# EAGLE design OperantFEDv3 (EAGLE 7.7.0)
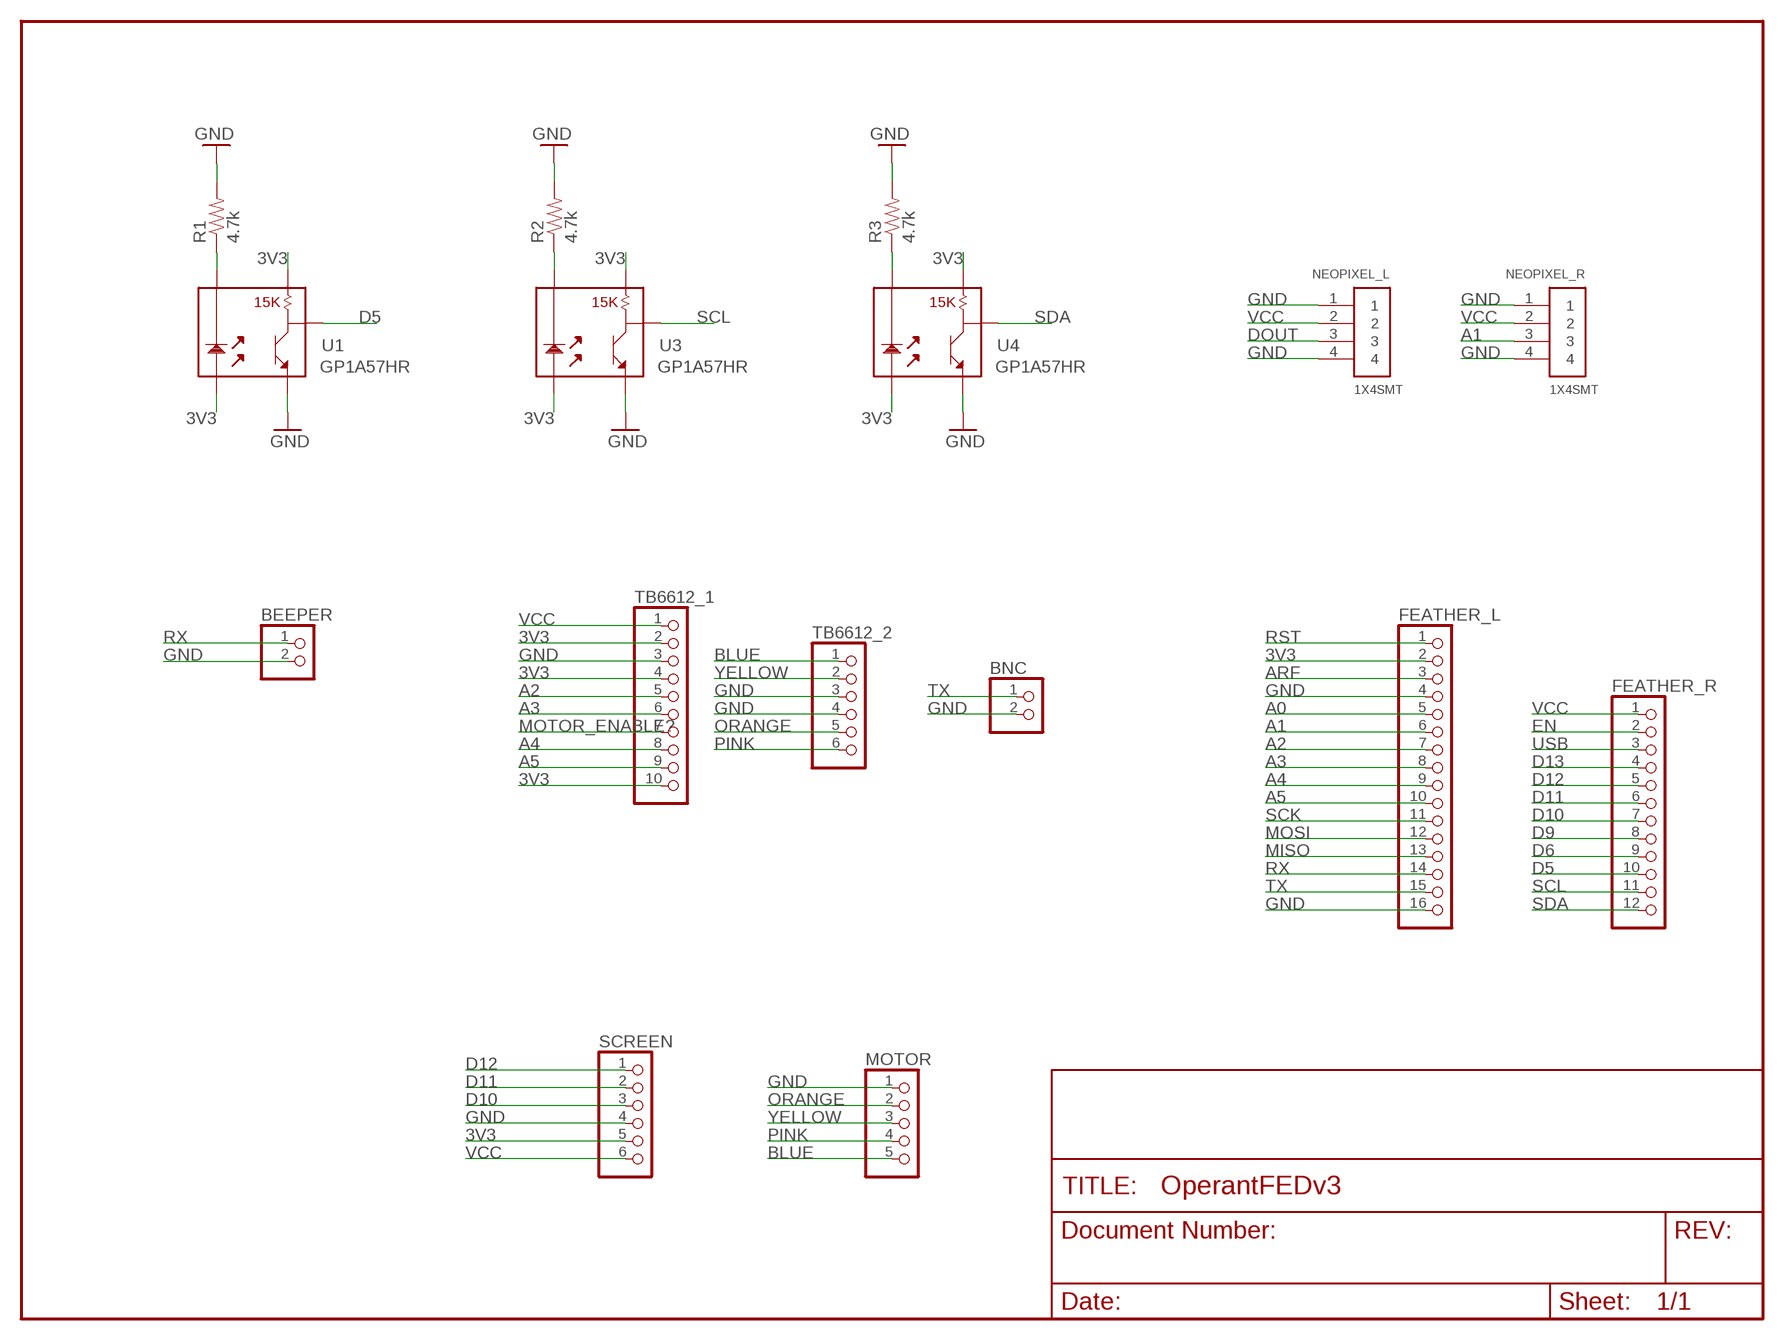
[diagram p0: schematic, sheet 1]

## Parts
BEEPER  PINHD-1X2  [1X02]
BNC  PINHD-1X2  [1X02]
FEATHER_L  PINHD-1X16  [1X16]
FEATHER_R  PINHD-1X12  [1X12]
MOTOR  PINHD-1X5  [1X05]
NEOPIXEL_L  1X4SMT  [1X4-SMT]
NEOPIXEL_R  1X4SMT  [1X4-SMT]
R1  4.7k  RESISTORPTH1  [AXIAL-0.3]
R2  4.7k  RESISTORPTH1  [AXIAL-0.3]
R3  4.7k  RESISTORPTH1  [AXIAL-0.3]
SCREEN  PINHD-1X6  [1X06]
TB6612_1  PINHD-1X10  [1X10]
TB6612_2  PINHD-1X6  [1X06]
U1  GP1A57HR  [GP1A57HR]
U3  GP1A57HR  [GP1A57HR]
U4  GP1A57HR  [GP1A57HR]

## Nets
3V3: FEATHER_L.2 SCREEN.5 TB6612_1.2 TB6612_1.4 TB6612_1.10 U1.1 U1.3 U3.1 U3.3 U4.1 U4.3
A0: FEATHER_L.5
A1: FEATHER_L.6 NEOPIXEL_R.3
A2: FEATHER_L.7 TB6612_1.5
A3: FEATHER_L.8 TB6612_1.6
A4: FEATHER_L.9 TB6612_1.8
A5: FEATHER_L.10 TB6612_1.9
ARF: FEATHER_L.3
BLUE: MOTOR.5 TB6612_2.1
D5: FEATHER_R.10 U1.4
D6: FEATHER_R.9
D9: FEATHER_R.8
D10: FEATHER_R.7 SCREEN.3
D11: FEATHER_R.6 SCREEN.2
D12: FEATHER_R.5 SCREEN.1
D13: FEATHER_R.4
DOUT: NEOPIXEL_L.3
EN: FEATHER_R.2
GND: BEEPER.2 BNC.2 FEATHER_L.4 FEATHER_L.16 MOTOR.1 NEOPIXEL_L.1 NEOPIXEL_L.4 NEOPIXEL_R.1 NEOPIXEL_R.4 R1.P$2 R2.P$2 R3.P$2 SCREEN.4 TB6612_1.3 TB6612_2.3 TB6612_2.4 U1.5 U3.5 U4.5
MISO: FEATHER_L.13
MOSI: FEATHER_L.12
MOTOR_ENABLE?: TB6612_1.7
N$1: R2.P$1 U3.2
N$2: R1.P$1 U1.2
N$3: R3.P$1 U4.2
ORANGE: MOTOR.2 TB6612_2.5
PINK: MOTOR.4 TB6612_2.6
RST: FEATHER_L.1
RX: BEEPER.1 FEATHER_L.14
SCK: FEATHER_L.11
SCL: FEATHER_R.11 U3.4
SDA: FEATHER_R.12 U4.4
TX: BNC.1 FEATHER_L.15
USB: FEATHER_R.3
VCC: FEATHER_R.1 NEOPIXEL_L.2 NEOPIXEL_R.2 SCREEN.6 TB6612_1.1
YELLOW: MOTOR.3 TB6612_2.2

## Library data of the parts
BEEPER BNC = pinhead:PINHD-1X2: PIN HEADER
FEATHER_L = pinhead:PINHD-1X16: PIN HEADER
FEATHER_R = pinhead:PINHD-1X12: PIN HEADER
MOTOR = pinhead:PINHD-1X5: PIN HEADER
NEOPIXEL_L NEOPIXEL_R = adafruit:1X4: 4-pin connector
R1-R3 = SparkFun:RESISTOR: Resistor Basic schematic elements and footprints for 0603, 1206, and PTH 1/10th watt (small) resistors.
SCREEN TB6612_2 = pinhead:PINHD-1X6: PIN HEADER
TB6612_1 = pinhead:PINHD-1X10: PIN HEADER
U1 U3 U4 = SparkFun:GP1A57HR

## Board
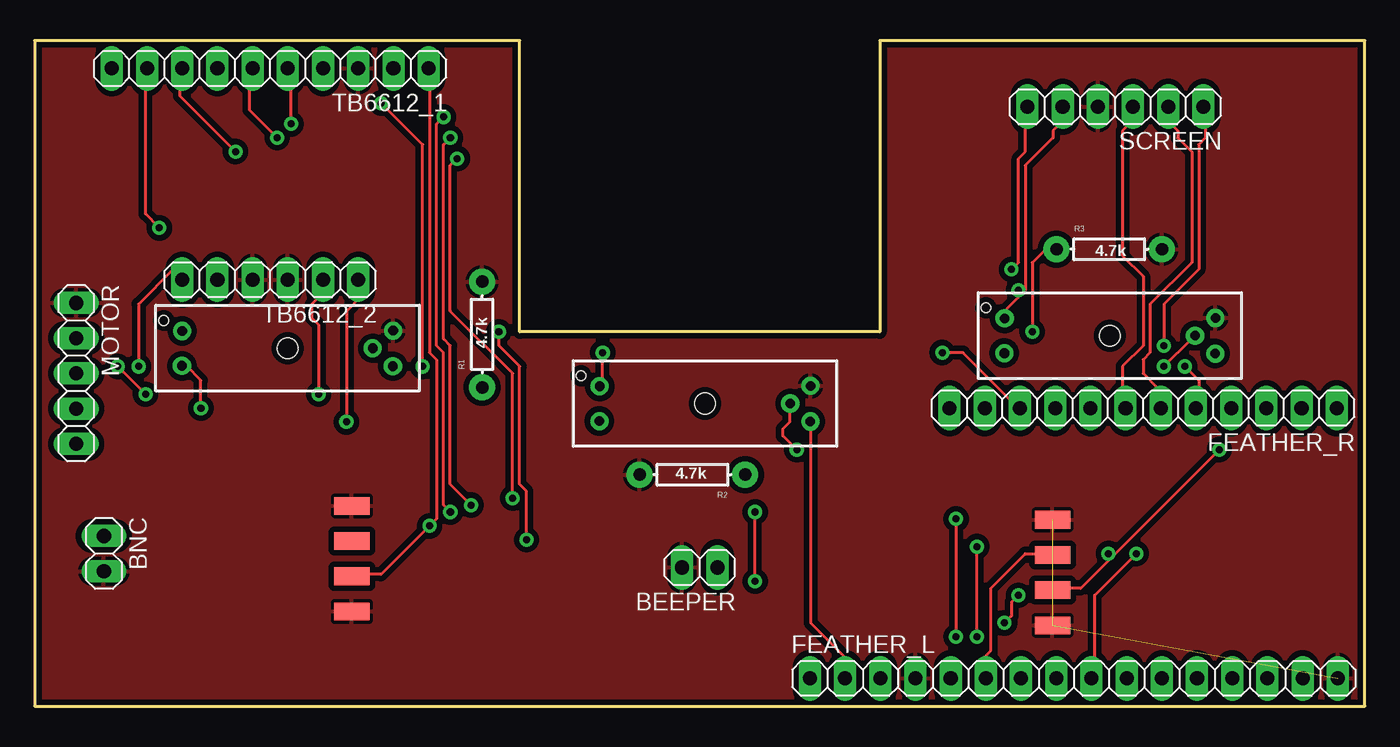
[diagram p1: board, top side]
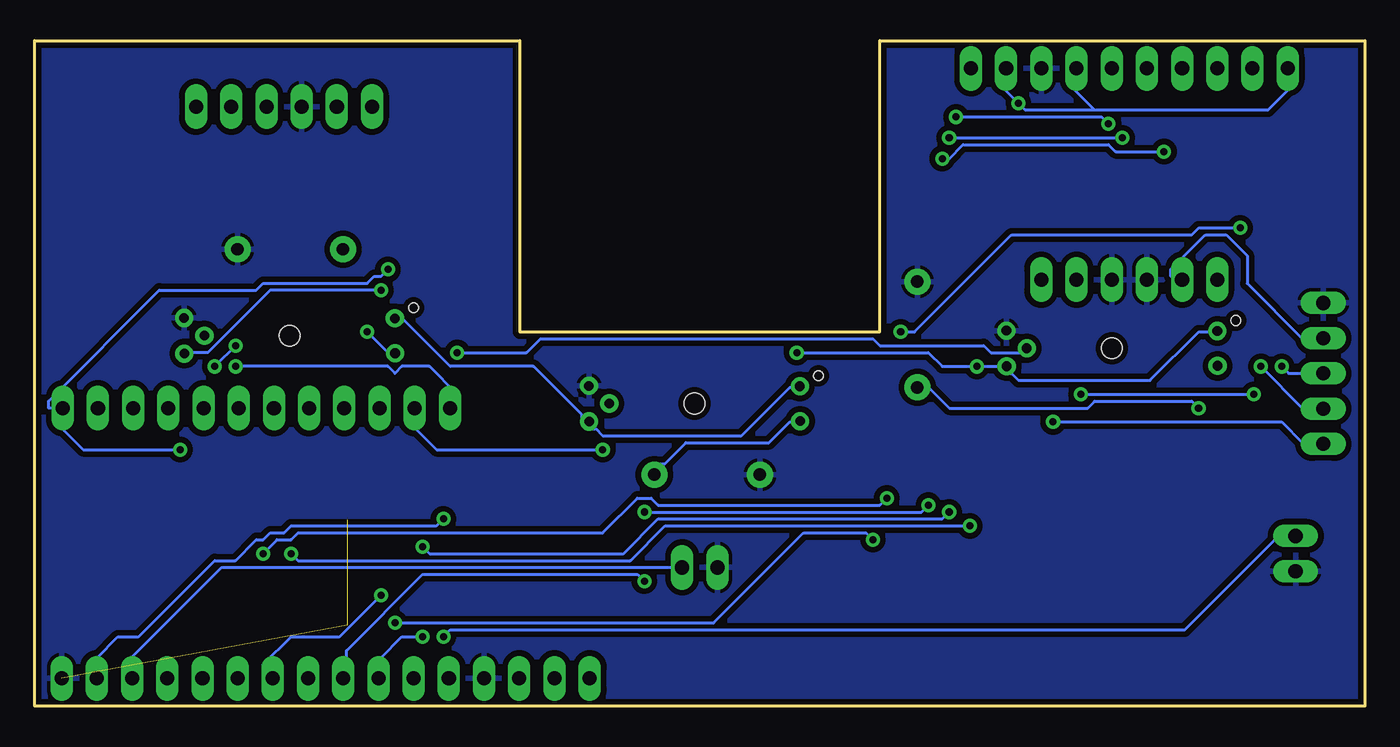
[diagram p2: board, bottom side, seen from below]

Size 96 x 48 mm. Coordinates in mm from the lower left corner, seen from the top.
Outline: 0,0 96,0 96,48 61,48 61,27 35,27 35,48 0,48 0,0
Copper layers (1*16): Top 0.0356mm / dielectric 1.5011mm / Bottom 0.0356mm
Design rules "default": minimum track width 8mil, minimum drill 20mil, track to track 8mil, track to pad 8mil, pad to pad 8mil, via to via 8mil, smd to smd 8mil, copper to edge 10mil, drill to drill 8mil, minimum pad ring 12mil, minimum via ring 10mil, stop-mask expansion 4mil, vias tented up to drill 20mil, thermal gap 10mil

### Footprints (pad centres in the part's own frame; a part is rotated, then mirrored left to right if it is on the bottom)
1X02 = drill 1.016 long: 1 -1.27,0; 2 1.27,0
1X16 = drill 1.016 long: 1 -19.05,0; 2 -16.51,0; 3 -13.97,0; 4 -11.43,0; 5 -8.89,0; 6 -6.35,0; 7 -3.81,0; 8 -1.27,0; 9 1.27,0; 10 3.81,0; 11 6.35,0; 12 8.89,0; 13 11.43,0; 14 13.97,0; 15 16.51,0; 16 19.05,0
1X12 = drill 1.016 long: 1 -13.97,0; 2 -11.43,0; 3 -8.89,0; 4 -6.35,0; 5 -3.81,0; 6 -1.27,0; 7 1.27,0; 8 3.81,0; 9 6.35,0; 10 8.89,0; 11 11.43,0; 12 13.97,0
1X05 = drill 1.016 long: 1 -5.08,0; 2 -2.54,0; 3 0,0; 4 2.54,0; 5 5.08,0
1X4-SMT = smd 1.27 x 2.54: 1 -3.81,0; 2 -1.27,0; 3 1.27,0; 4 3.81,0
AXIAL-0.3 = drill 0.9 pad 1.88: P$1 -3.81,0; P$2 3.81,0
1X06 = drill 1.016 long: 1 -6.35,0; 2 -3.81,0; 3 -1.27,0; 4 1.27,0; 5 3.81,0; 6 6.35,0
1X10 = drill 1.016 long: 1 -11.43,0; 2 -8.89,0; 3 -6.35,0; 4 -3.81,0; 5 -1.27,0; 6 1.27,0; 7 3.81,0; 8 6.35,0; 9 8.89,0; 10 11.43,0
GP1A57HR = drill 0.7: 1 -7.6,1.24; 2 -7.62,-1.27; 3 7.6,-1.3; 4 6.15,0; 5 7.62,1.27 | hole 1.5: 0,0 | hole 0.7: -8.95,2

### Placement (x,y rotation side)
BEEPER  48,10 180 top
BNC  5,11 270 top
FEATHER_L  75,2 0 top
FEATHER_R  80,21.5 180 top
MOTOR  3,24 270 top
NEOPIXEL_L  22.89,10.63 90 top
NEOPIXEL_R  73.46,9.63 90 top
R1  32.29,26.81 90 top
R2  47.47,16.69 180 top
R3  77.55,32.96 0 top
SCREEN  78,43.24 180 top
TB6612_1  17,46 180 top
TB6612_2  17,30.76 180 top
U1  18.25,25.82 0 top
U3  48.38,21.83 0 top
U4  77.6,26.73 0 top

### Tracks (layer width: path | path; a pad name or v marks a point on that pad's centre or on a via)
3V3  (via drill 0.51)
  Top 0.203: U4.1 70,28.5 71,29.5 | 71,29.5 71.5,30 71.5,39 73.5,41 73.5,41.5 74,42 74,43 SCREEN.5 | 71,29.5 v71,30 | FEATHER_L.2 58.5,3.5 56,6 56,20.5 U3.3 | v41,25.5 41,23.5 U3.1 | v25,43.5 28,40.5 v28,24.5
  Bottom 0.203: v71,30 79,30 83.5,25.5 85,25.5 U4.3 | 19.5,43 21,44.5 21,46 TB6612_1.4 | 19.5,43 7,43 5,45 5,46 TB6612_1.10 | 19.5,43 24.5,43 v25,43.5 26,44.5 26,46 TB6612_1.2 | 26,24.5 26,24 25.5,24 25,23.5 15.5,23.5 12,27 11,27 U1.1 | 56,20.5 56,20 55.5,20 55,19.5 45,19.5 41.5,23 41,23 U3.1 | 26,24.5 v28,24.5 30.5,24.5 31.5,25.5 v41,25.5 | 26,24.5 U1.3 | 56,20.5 56.5,20.5 56.5,21 60,24.5 66,24.5 69.5,28 70,28 U4.1 | 56,20.5 U3.3
A1
  Top 0.203: NEOPIXEL_R.3 73,11 71.5,11 69,8.5 69,4 68.5,3.5 68.5,2 FEATHER_L.6
A2  (via drill 0.51)
  Top 0.203: v18.5,42 18.5,46 TB6612_1.5 | v29.5,42.5 29,42 29,26 29.5,25.5 29.5,14.5 v30,14 | v68,5 v68,11.5
  Bottom 0.203: v18.5,42 19,42.5 v29.5,42.5 | v30,14 30.5,13.5 51,13.5 53.5,11 67.5,11 v68,11.5 | v68,5 69.5,5 71,3.5 71,2 FEATHER_L.7
A3  (via drill 0.51)
  Top 0.203: v17.5,41 15.5,43 15.5,46 TB6612_1.6 | v30,41 29.5,40.5 29.5,26.5 30,26 30,16 v31.5,14.5 | v52,9 v52,14
  Bottom 0.203: v30,41 v17.5,41 | v31.5,14.5 32,14 v52,14 | v52,9 52.5,9.5 68,9.5 73.5,4 73.5,2 FEATHER_L.8
A4  (via drill 0.51)
  Top 0.203: v14.5,40 10.5,44 10.5,46 TB6612_1.8 | v30.5,39.5 30,39 30,28.5 34.5,24 v34.5,15 | v79.5,11 76.5,8 76.5,2 FEATHER_L.9
  Bottom 0.203: v14.5,40 18,40 18.5,40.5 29,40.5 30,39.5 v30.5,39.5 | v34.5,15 35,14.5 51,14.5 51.5,15 52.5,15 55,12.5 77,12.5 77.5,12 78.5,12 v79.5,11
A5  (via drill 0.51)
  Top 0.203: v9,34.5 8,35.5 8,46 TB6612_1.9 | v33.5,27 33.5,26 35,24.5 35,16 35.5,15.5 v35.5,12 | v70,6 70.5,6.5 70.5,7.5 v71,8
  Bottom 0.203: v9,34.5 12,34.5 12.5,34 25.5,34 32.5,27 v33.5,27 | v35.5,12 36,12.5 40.5,12.5 47,6 v70,6 | v71,8 74,5 77.5,5 79.5,3 79.5,2 FEATHER_L.10
BLUE  (via drill 0.51)
  Top 0.203: v22.5,20.5 22.5,28.5 23.5,29.5 23.5,30.5 TB6612_2.1
  Bottom 0.203: v22.5,20.5 6,20.5 4.5,19 3,19 MOTOR.5
D5  (via drill 0.51)
  Top 0.203: v65.5,25.5 67,25.5 70.5,22 71,22 71,21.5 FEATHER_R.10
  Bottom 0.203: v65.5,25.5 60.5,25.5 59.5,26.5 35.5,26.5 35,26 27.5,26 27,25.5 24.5,25.5 U1.4
D10
  Top 0.203: FEATHER_R.7 78.5,21.5 78.5,24.5 80,26 80,31 78.5,32.5 78.5,41.5 79.5,42.5 79.5,43 SCREEN.3
D11
  Top 0.203: FEATHER_R.6 81,21.5 81,23 80,24 80,25 80.5,25.5 80.5,29 83.5,32 83.5,40 82.5,41 82.5,41.5 82,42 82,43 SCREEN.2
D12  (via drill 0.51)
  Top 0.203: v83,24.5 84,23.5 84,21.5 FEATHER_R.5 | v81.5,26 81.5,29 84,31.5 84,40.5 84.5,41 84.5,43 SCREEN.1
  Bottom 0.203: v81.5,26 v83,24.5
GND  (2 unrouted)
  pour Top (isolate 0.406): -5,-2.93 99.74,-2.93 99.74,66.1 -5,66.1
  pour Bottom (isolate 0.406): -6.97,66.97 -6.97,-5.05 101.44,-4.95 101.44,67.07
N$1
  Bottom 0.203: U3.2 41,20.5 41.5,20.5 43,19 49,19 50.5,17.5 51.5,17.5 51.5,17 R2.P$1
N$2  (via drill 0.51)
  Top 0.203: v12,21.5 12,23.5 11,24.5 U1.2
  Bottom 0.203: v12,21.5 12.5,22 19.5,22 20,21.5 30,21.5 31.5,23 R1.P$1
N$3  (via drill 0.51)
  Top 0.203: v72,27 72,32 73,33 73.5,33 R3.P$1
  Bottom 0.203: v72,27 70.5,25.5 70,25.5 U4.2
ORANGE
  Bottom 0.203: MOTOR.2 3,26.5 4.5,26.5 8.5,30.5 8.5,32.5 10,34 11.5,34 14,31.5 14,31 13.5,31 TB6612_2.5
PINK  (via drill 0.51)
  Top 0.203: v7.5,24.5 7.5,29 10,31.5 10.5,31.5 10.5,31 TB6612_2.6
  Bottom 0.203: v7.5,24.5 4.5,21.5 3,21.5 MOTOR.4
RX
  Bottom 0.203: BEEPER.1 82.5,10 89.5,3 89.5,2 FEATHER_L.14
SCL  (via drill 0.51)
  Top 0.203: v55,18.5 54,19.5 54,20 54.5,20.5 54.5,21.5 U3.4
  Bottom 0.203: v55,18.5 67,18.5 68.5,20 68.5,21.5 FEATHER_R.11
SDA  (via drill 0.51)
  Top 0.203: v81.5,24.5 83.5,26.5 U4.4
  Bottom 0.203: v81.5,24.5 70.5,24.5 70,24 69.5,24.5 67.5,24.5 65.5,22.5 65.5,21.5 FEATHER_R.12
TX  (via drill 0.51)
  Top 0.203: v66.5,13.5 v66.5,5
  Bottom 0.203: v66.5,5 66,5.5 13,5.5 6.5,12 5,12 BNC.1 | v66.5,13.5 67,13 77.5,13 78,12.5 79,12.5 79.5,12 80,12 81.5,10.5 83,10.5 88.5,5 90,5 91.5,3.5 FEATHER_L.15
VCC  (via drill 0.51)
  Top 0.203: NEOPIXEL_L.2 23,9.5 25,9.5 v28.5,13 29,13.5 29,25 28.5,25.5 28.5,46 TB6612_1.1 | v85.5,18.5 77.5,10.5 | 77.5,10.5 75.5,8.5 73.5,8.5 NEOPIXEL_R.2 | v70.5,31.5 71,32 71,39.5 71.5,40 71.5,43 SCREEN.6 | 77.5,10.5 v77.5,11
  Bottom 0.203: v85.5,18.5 92.5,18.5 94.5,20.5 94.5,21.5 | 94.5,21.5 FEATHER_R.1 94,21.5 | v70.5,31.5 71,31 71.5,31 72,30.5 79.5,30.5 80,30 87,30 95,22 95,21.5 94.5,21.5 | v28.5,13 50.5,13 53,10.5 77,10.5 v77.5,11
YELLOW  (via drill 0.51)
  Top 0.203: v8,22.5 v6,24.5 | v20.5,22.5 20.5,27.5 20,28 20,29 21,30 21,30.5 TB6612_2.2
  Bottom 0.203: MOTOR.3 5.5,24 v6,24.5 | v20.5,22.5 v8,22.5